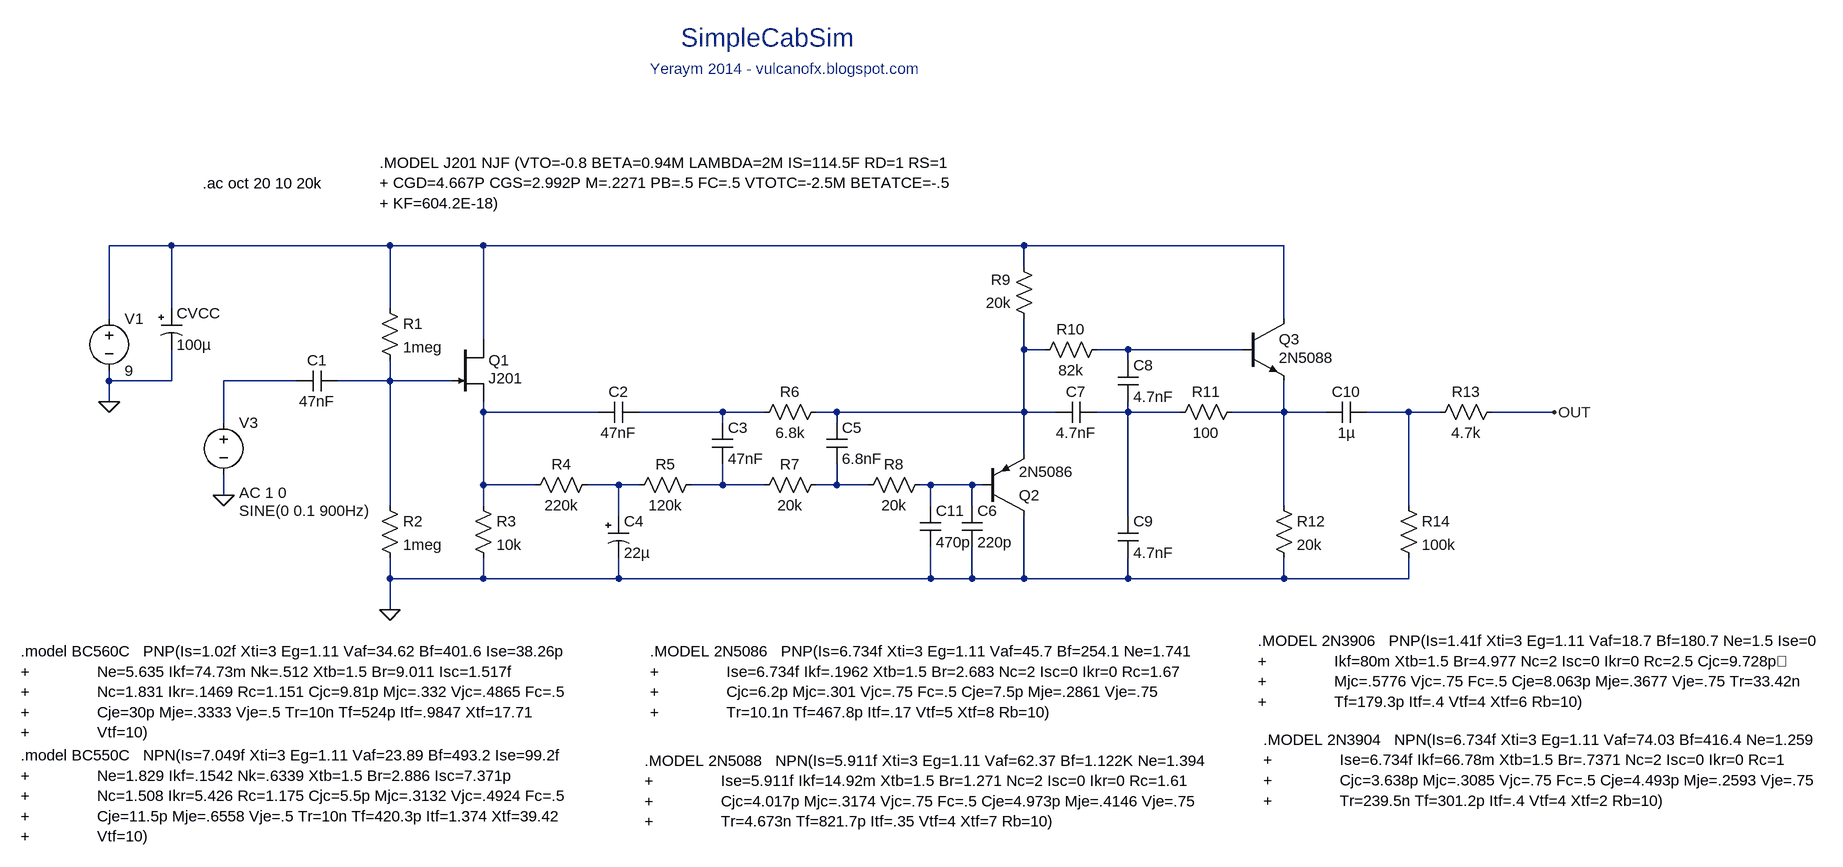
[diagram p0: schematic SimpleCabSim_yeraym_vulcanofx.asc]
SimpleCabSim_yeraym_vulcanofx.asc, the LTspice schematic file:
Version 4
SHEET 1 2860 1924
WIRE -752 400 -848 400
WIRE -416 400 -752 400
WIRE -272 400 -416 400
WIRE 560 400 -272 400
WIRE 960 400 560 400
WIRE 560 432 560 400
WIRE -752 496 -752 400
WIRE -416 496 -416 400
WIRE -848 512 -848 400
WIRE 960 512 960 400
WIRE -272 544 -272 400
WIRE 560 560 560 512
WIRE 592 560 560 560
WIRE 720 560 672 560
WIRE 896 560 720 560
WIRE 720 576 720 560
WIRE -848 608 -848 592
WIRE -752 608 -752 560
WIRE -752 608 -848 608
WIRE -560 608 -672 608
WIRE -416 608 -416 576
WIRE -416 608 -496 608
WIRE -320 608 -416 608
WIRE -848 640 -848 608
WIRE -272 656 -272 640
WIRE -96 656 -272 656
WIRE 96 656 -32 656
WIRE 160 656 96 656
WIRE 272 656 240 656
WIRE 560 656 560 560
WIRE 560 656 272 656
WIRE 608 656 560 656
WIRE 720 656 720 640
WIRE 720 656 672 656
WIRE 800 656 720 656
WIRE 960 656 960 608
WIRE 960 656 880 656
WIRE 1024 656 960 656
WIRE 1152 656 1088 656
WIRE 1200 656 1152 656
WIRE 1376 656 1280 656
WIRE -672 672 -672 608
WIRE 96 672 96 656
WIRE 272 672 272 656
WIRE 560 720 560 656
WIRE -272 768 -272 656
WIRE -192 768 -272 768
WIRE -64 768 -112 768
WIRE -32 768 -64 768
WIRE 96 768 96 736
WIRE 96 768 48 768
WIRE 160 768 96 768
WIRE 272 768 272 736
WIRE 272 768 240 768
WIRE 320 768 272 768
WIRE 416 768 400 768
WIRE 480 768 416 768
WIRE 496 768 480 768
WIRE -672 784 -672 752
WIRE -416 800 -416 608
WIRE -272 800 -272 768
WIRE 416 800 416 768
WIRE 480 800 480 768
WIRE 960 800 960 656
WIRE 1152 800 1152 656
WIRE -64 816 -64 768
WIRE 720 816 720 656
WIRE -416 912 -416 880
WIRE -272 912 -272 880
WIRE -272 912 -416 912
WIRE -64 912 -64 880
WIRE -64 912 -272 912
WIRE 416 912 416 864
WIRE 416 912 -64 912
WIRE 480 912 480 864
WIRE 480 912 416 912
WIRE 560 912 560 816
WIRE 560 912 480 912
WIRE 720 912 720 880
WIRE 720 912 560 912
WIRE 960 912 960 880
WIRE 960 912 720 912
WIRE 1152 912 1152 880
WIRE 1152 912 960 912
WIRE -416 960 -416 912
FLAG -848 640 0
FLAG -672 784 0
FLAG -416 960 0
FLAG 1376 656 OUT
SYMBOL voltage -848 496 R0
WINDOW 123 0 0 Left 2
WINDOW 39 0 0 Left 2
SYMATTR InstName V1
SYMATTR Value 9
SYMBOL voltage -672 656 R0
WINDOW 3 24 152 Left 2
WINDOW 123 24 124 Left 2
WINDOW 39 24 124 Left 2
SYMATTR Value SINE(0 0.1 900Hz)
SYMATTR Value2 AC 1 0
SYMATTR InstName V3
SYMBOL polcap -768 496 R0
SYMATTR InstName CVCC
SYMATTR Value 100µ
SYMATTR SpiceLine V=16 Irms=35m Rser=2.8 Lser=0
SYMBOL njf -320 544 R0
WINDOW 3 56 60 Left 2
SYMATTR Value J201
SYMATTR InstName Q1
SYMATTR Prefix ""
SYMBOL npn 896 512 R0
WINDOW 3 56 60 Left 2
SYMATTR Value 2N5088
SYMATTR InstName Q3
SYMATTR Prefix ""
SYMBOL pnp 496 816 M180
SYMATTR InstName Q2
SYMATTR Value 2N5086
SYMATTR Prefix ""
SYMBOL cap -496 592 R90
WINDOW 0 0 32 VBottom 2
WINDOW 3 32 32 VTop 2
SYMATTR InstName C1
SYMATTR Value 47nF
SYMBOL res -432 480 R0
SYMATTR InstName R1
SYMATTR Value 1meg
SYMBOL res -432 784 R0
SYMATTR InstName R2
SYMATTR Value 1meg
SYMBOL res -288 784 R0
SYMATTR InstName R3
SYMATTR Value 10k
SYMBOL cap -32 640 R90
WINDOW 0 0 32 VBottom 2
WINDOW 3 32 32 VTop 2
SYMATTR InstName C2
SYMATTR Value 47nF
SYMBOL res -96 752 R90
WINDOW 0 0 56 VBottom 2
WINDOW 3 32 56 VTop 2
SYMATTR InstName R4
SYMATTR Value 220k
SYMBOL res 64 752 R90
WINDOW 0 0 56 VBottom 2
WINDOW 3 32 56 VTop 2
SYMATTR InstName R5
SYMATTR Value 120k
SYMBOL cap 80 672 R0
SYMATTR InstName C3
SYMATTR Value 47nF
SYMBOL res 256 752 R90
WINDOW 0 0 56 VBottom 2
WINDOW 3 32 56 VTop 2
SYMATTR InstName R7
SYMATTR Value 20k
SYMBOL cap 256 672 R0
SYMATTR InstName C5
SYMATTR Value 6.8nF
SYMBOL res 416 752 R90
WINDOW 0 0 56 VBottom 2
WINDOW 3 32 56 VTop 2
SYMATTR InstName R8
SYMATTR Value 20k
SYMBOL cap 464 800 R0
SYMATTR InstName C6
SYMATTR Value 220p
SYMBOL res 256 640 R90
WINDOW 0 0 56 VBottom 2
WINDOW 3 32 56 VTop 2
SYMATTR InstName R6
SYMATTR Value 6.8k
SYMBOL cap 672 640 R90
WINDOW 0 0 32 VBottom 2
WINDOW 3 32 32 VTop 2
SYMATTR InstName C7
SYMATTR Value 4.7nF
SYMBOL res 688 544 R90
WINDOW 0 0 56 VBottom 2
WINDOW 3 32 56 VTop 2
SYMATTR InstName R10
SYMATTR Value 82k
SYMBOL res 576 528 R180
WINDOW 0 36 76 Left 2
WINDOW 3 36 40 Left 2
SYMATTR InstName R9
SYMATTR Value 20k
SYMBOL cap 704 576 R0
SYMATTR InstName C8
SYMATTR Value 4.7nF
SYMBOL cap 704 816 R0
SYMATTR InstName C9
SYMATTR Value 4.7nF
SYMBOL res 896 640 R90
WINDOW 0 0 56 VBottom 2
WINDOW 3 32 56 VTop 2
SYMATTR InstName R11
SYMATTR Value 100
SYMBOL res 944 784 R0
SYMATTR InstName R12
SYMATTR Value 20k
SYMBOL res 1136 784 R0
SYMATTR InstName R14
SYMATTR Value 100k
SYMBOL cap 1088 640 R90
WINDOW 0 0 32 VBottom 2
WINDOW 3 32 32 VTop 2
SYMATTR InstName C10
SYMATTR Value 1µ
SYMBOL res 1296 640 R90
WINDOW 0 0 56 VBottom 2
WINDOW 3 32 56 VTop 2
SYMATTR InstName R13
SYMATTR Value 4.7k
SYMBOL polcap -80 816 R0
SYMATTR InstName C4
SYMATTR Value 22µ
SYMATTR SpiceLine V=16 Irms=35m Rser=2.8 Lser=0
SYMBOL cap 400 800 R0
SYMATTR InstName C11
SYMATTR Value 470p
TEXT -704 304 Left 2 !.ac oct 20 10 20k
TEXT -432 272 Left 2 !.MODEL J201 NJF (VTO=-0.8 BETA=0.94M LAMBDA=2M IS=114.5F RD=1 RS=1\n+ CGD=4.667P CGS=2.992P M=.2271 PB=.5 FC=.5 VTOTC=-2.5M BETATCE=-.5\n+ KF=604.2E-18)
TEXT 928 1160 Left 2 !.MODEL 2N3904   NPN(Is=6.734f Xti=3 Eg=1.11 Vaf=74.03 Bf=416.4 Ne=1.259\n+               Ise=6.734f Ikf=66.78m Xtb=1.5 Br=.7371 Nc=2 Isc=0 Ikr=0 Rc=1\n+               Cjc=3.638p Mjc=.3085 Vjc=.75 Fc=.5 Cje=4.493p Mje=.2593 Vje=.75\n+               Tr=239.5n Tf=301.2p Itf=.4 Vtf=4 Xtf=2 Rb=10)
TEXT 920 1008 Left 2 !.MODEL 2N3906   PNP(Is=1.41f Xti=3 Eg=1.11 Vaf=18.7 Bf=180.7 Ne=1.5 Ise=0\n+               Ikf=80m Xtb=1.5 Br=4.977 Nc=2 Isc=0 Ikr=0 Rc=2.5 Cjc=9.728p\n+               Mjc=.5776 Vjc=.75 Fc=.5 Cje=8.063p Mje=.3677 Vje=.75 Tr=33.42n\n+               Tf=179.3p Itf=.4 Vtf=4 Xtf=6 Rb=10)
TEXT -16 1024 Left 2 !.MODEL 2N5086   PNP(Is=6.734f Xti=3 Eg=1.11 Vaf=45.7 Bf=254.1 Ne=1.741\n+               Ise=6.734f Ikf=.1962 Xtb=1.5 Br=2.683 Nc=2 Isc=0 Ikr=0 Rc=1.67\n+               Cjc=6.2p Mjc=.301 Vjc=.75 Fc=.5 Cje=7.5p Mje=.2861 Vje=.75\n+               Tr=10.1n Tf=467.8p Itf=.17 Vtf=5 Xtf=8 Rb=10)
TEXT -24 1192 Left 2 !.MODEL 2N5088   NPN(Is=5.911f Xti=3 Eg=1.11 Vaf=62.37 Bf=1.122K Ne=1.394\n+               Ise=5.911f Ikf=14.92m Xtb=1.5 Br=1.271 Nc=2 Isc=0 Ikr=0 Rc=1.61\n+               Cjc=4.017p Mjc=.3174 Vjc=.75 Fc=.5 Cje=4.973p Mje=.4146 Vje=.75\n+               Tr=4.673n Tf=821.7p Itf=.35 Vtf=4 Xtf=7 Rb=10)
TEXT -984 1184 Left 2 !.model BC550C   NPN(Is=7.049f Xti=3 Eg=1.11 Vaf=23.89 Bf=493.2 Ise=99.2f\n+               Ne=1.829 Ikf=.1542 Nk=.6339 Xtb=1.5 Br=2.886 Isc=7.371p\n+               Nc=1.508 Ikr=5.426 Rc=1.175 Cjc=5.5p Mjc=.3132 Vjc=.4924 Fc=.5\n+               Cje=11.5p Mje=.6558 Vje=.5 Tr=10n Tf=420.3p Itf=1.374 Xtf=39.42\n+               Vtf=10)
TEXT -984 1024 Left 2 !.model BC560C   PNP(Is=1.02f Xti=3 Eg=1.11 Vaf=34.62 Bf=401.6 Ise=38.26p\n+               Ne=5.635 Ikf=74.73m Nk=.512 Xtb=1.5 Br=9.011 Isc=1.517f\n+               Nc=1.831 Ikr=.1469 Rc=1.151 Cjc=9.81p Mjc=.332 Vjc=.4865 Fc=.5\n+               Cje=30p Mje=.3333 Vje=.5 Tr=10n Tf=524p Itf=.9847 Xtf=17.71\n+               Vtf=10)
TEXT 32 80 Left 4 ;SimpleCabSim
TEXT -16 128 Left 2 ;Yeraym 2014 - vulcanofx.blogspot.com

The netlist it stands for:
* SimpleCabSim_yeraym_vulcanofx.asc
V1 N001 0 9
V3 N004 0 SINE(0 0.1 900Hz) AC 1 0
CVCC N001 0 100µ V=16 Irms=35m Rser=2.8 Lser=0
XQ1 N001 N005 N006 J201  ; pins D G S
XQ3 N001 N003 N009 2N5088  ; pins C B E
XQ2 0 N014 N002 2N5086  ; pins C B E
C1 N005 N004 47nF
R1 N001 N005 1meg
R2 N005 0 1meg
R3 N006 0 10k
C2 N007 N006 47nF
R4 N011 N006 220k
R5 N012 N011 120k
C3 N007 N012 47nF
R7 N013 N012 20k
C5 N002 N013 6.8nF
R8 N014 N013 20k
C6 N014 0 220p
R6 N002 N007 6.8k
C7 N008 N002 4.7nF
R10 N003 N002 82k
R9 N002 N001 20k
C8 N003 N008 4.7nF
C9 N008 0 4.7nF
R11 N009 N008 100
R12 N009 0 20k
R14 N010 0 100k
C10 N010 N009 1µ
R13 OUT N010 4.7k
C4 N011 0 22µ V=16 Irms=35m Rser=2.8 Lser=0
C11 N014 0 470p
.ac oct 20 10 20k
.MODEL J201 NJF (VTO=-0.8 BETA=0.94M LAMBDA=2M IS=114.5F RD=1 RS=1
+ CGD=4.667P CGS=2.992P M=.2271 PB=.5 FC=.5 VTOTC=-2.5M BETATCE=-.5
+ KF=604.2E-18)
.MODEL 2N3904   NPN(Is=6.734f Xti=3 Eg=1.11 Vaf=74.03 Bf=416.4 Ne=1.259
+               Ise=6.734f Ikf=66.78m Xtb=1.5 Br=.7371 Nc=2 Isc=0 Ikr=0 Rc=1
+               Cjc=3.638p Mjc=.3085 Vjc=.75 Fc=.5 Cje=4.493p Mje=.2593 Vje=.75
+               Tr=239.5n Tf=301.2p Itf=.4 Vtf=4 Xtf=2 Rb=10)
.MODEL 2N3906   PNP(Is=1.41f Xti=3 Eg=1.11 Vaf=18.7 Bf=180.7 Ne=1.5 Ise=0
+               Ikf=80m Xtb=1.5 Br=4.977 Nc=2 Isc=0 Ikr=0 Rc=2.5 Cjc=9.728p
+               Mjc=.5776 Vjc=.75 Fc=.5 Cje=8.063p Mje=.3677 Vje=.75 Tr=33.42n
+               Tf=179.3p Itf=.4 Vtf=4 Xtf=6 Rb=10)
.MODEL 2N5086   PNP(Is=6.734f Xti=3 Eg=1.11 Vaf=45.7 Bf=254.1 Ne=1.741
+               Ise=6.734f Ikf=.1962 Xtb=1.5 Br=2.683 Nc=2 Isc=0 Ikr=0 Rc=1.67
+               Cjc=6.2p Mjc=.301 Vjc=.75 Fc=.5 Cje=7.5p Mje=.2861 Vje=.75
+               Tr=10.1n Tf=467.8p Itf=.17 Vtf=5 Xtf=8 Rb=10)
.MODEL 2N5088   NPN(Is=5.911f Xti=3 Eg=1.11 Vaf=62.37 Bf=1.122K Ne=1.394
+               Ise=5.911f Ikf=14.92m Xtb=1.5 Br=1.271 Nc=2 Isc=0 Ikr=0 Rc=1.61
+               Cjc=4.017p Mjc=.3174 Vjc=.75 Fc=.5 Cje=4.973p Mje=.4146 Vje=.75
+               Tr=4.673n Tf=821.7p Itf=.35 Vtf=4 Xtf=7 Rb=10)
.model BC550C   NPN(Is=7.049f Xti=3 Eg=1.11 Vaf=23.89 Bf=493.2 Ise=99.2f
+               Ne=1.829 Ikf=.1542 Nk=.6339 Xtb=1.5 Br=2.886 Isc=7.371p
+               Nc=1.508 Ikr=5.426 Rc=1.175 Cjc=5.5p Mjc=.3132 Vjc=.4924 Fc=.5
+               Cje=11.5p Mje=.6558 Vje=.5 Tr=10n Tf=420.3p Itf=1.374 Xtf=39.42
+               Vtf=10)
.model BC560C   PNP(Is=1.02f Xti=3 Eg=1.11 Vaf=34.62 Bf=401.6 Ise=38.26p
+               Ne=5.635 Ikf=74.73m Nk=.512 Xtb=1.5 Br=9.011 Isc=1.517f
+               Nc=1.831 Ikr=.1469 Rc=1.151 Cjc=9.81p Mjc=.332 Vjc=.4865 Fc=.5
+               Cje=30p Mje=.3333 Vje=.5 Tr=10n Tf=524p Itf=.9847 Xtf=17.71
+               Vtf=10)
* SimpleCabSim
* Yeraym 2014 - vulcanofx.blogspot.com
.backanno
.end